# Altium schematic sheet 04_USB_PWR.SchDoc: USB & POWER
size 594 x 420 mm; Author: T. Ludemann; SheetNumber: 4; SheetTotal: 8; DocSize: DINA2
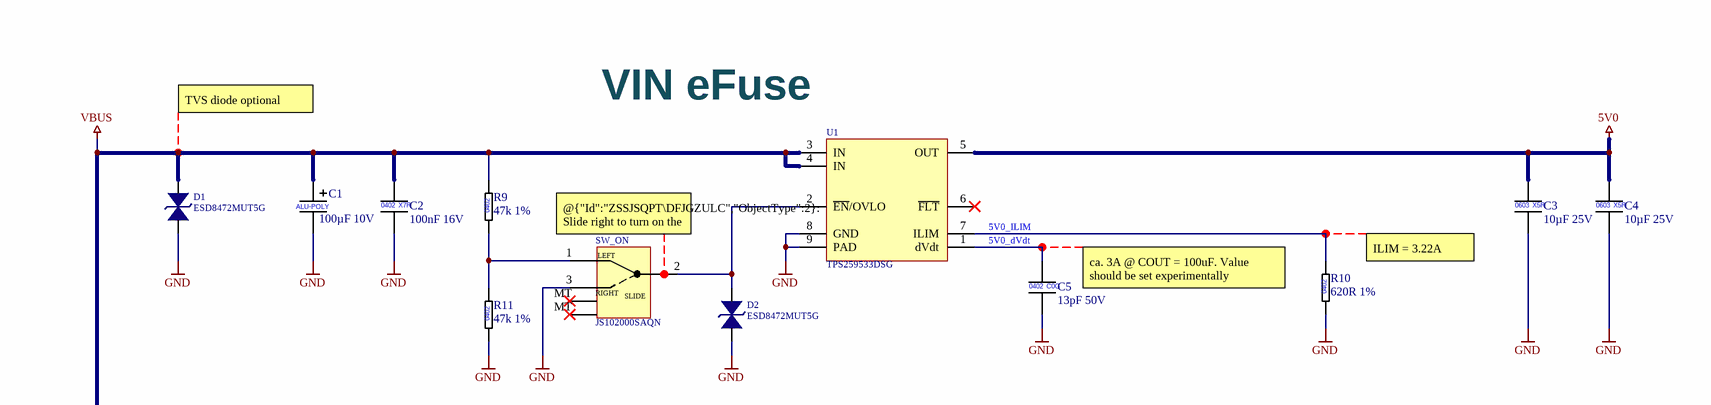
[diagram p0: 04_USB_PWR.SchDoc, top left]
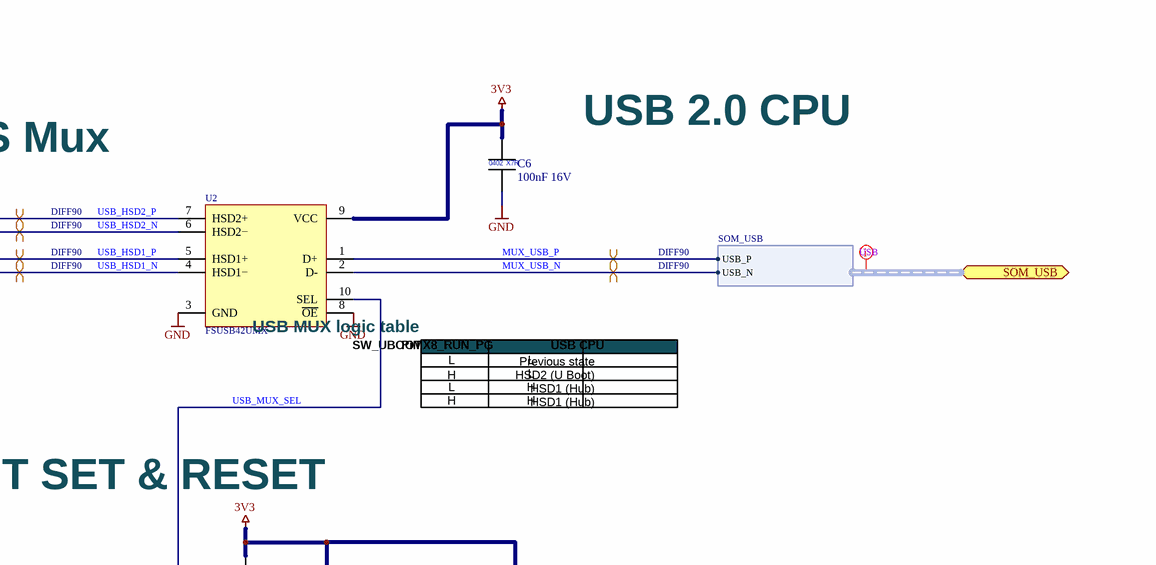
[diagram p1: 04_USB_PWR.SchDoc, top right]
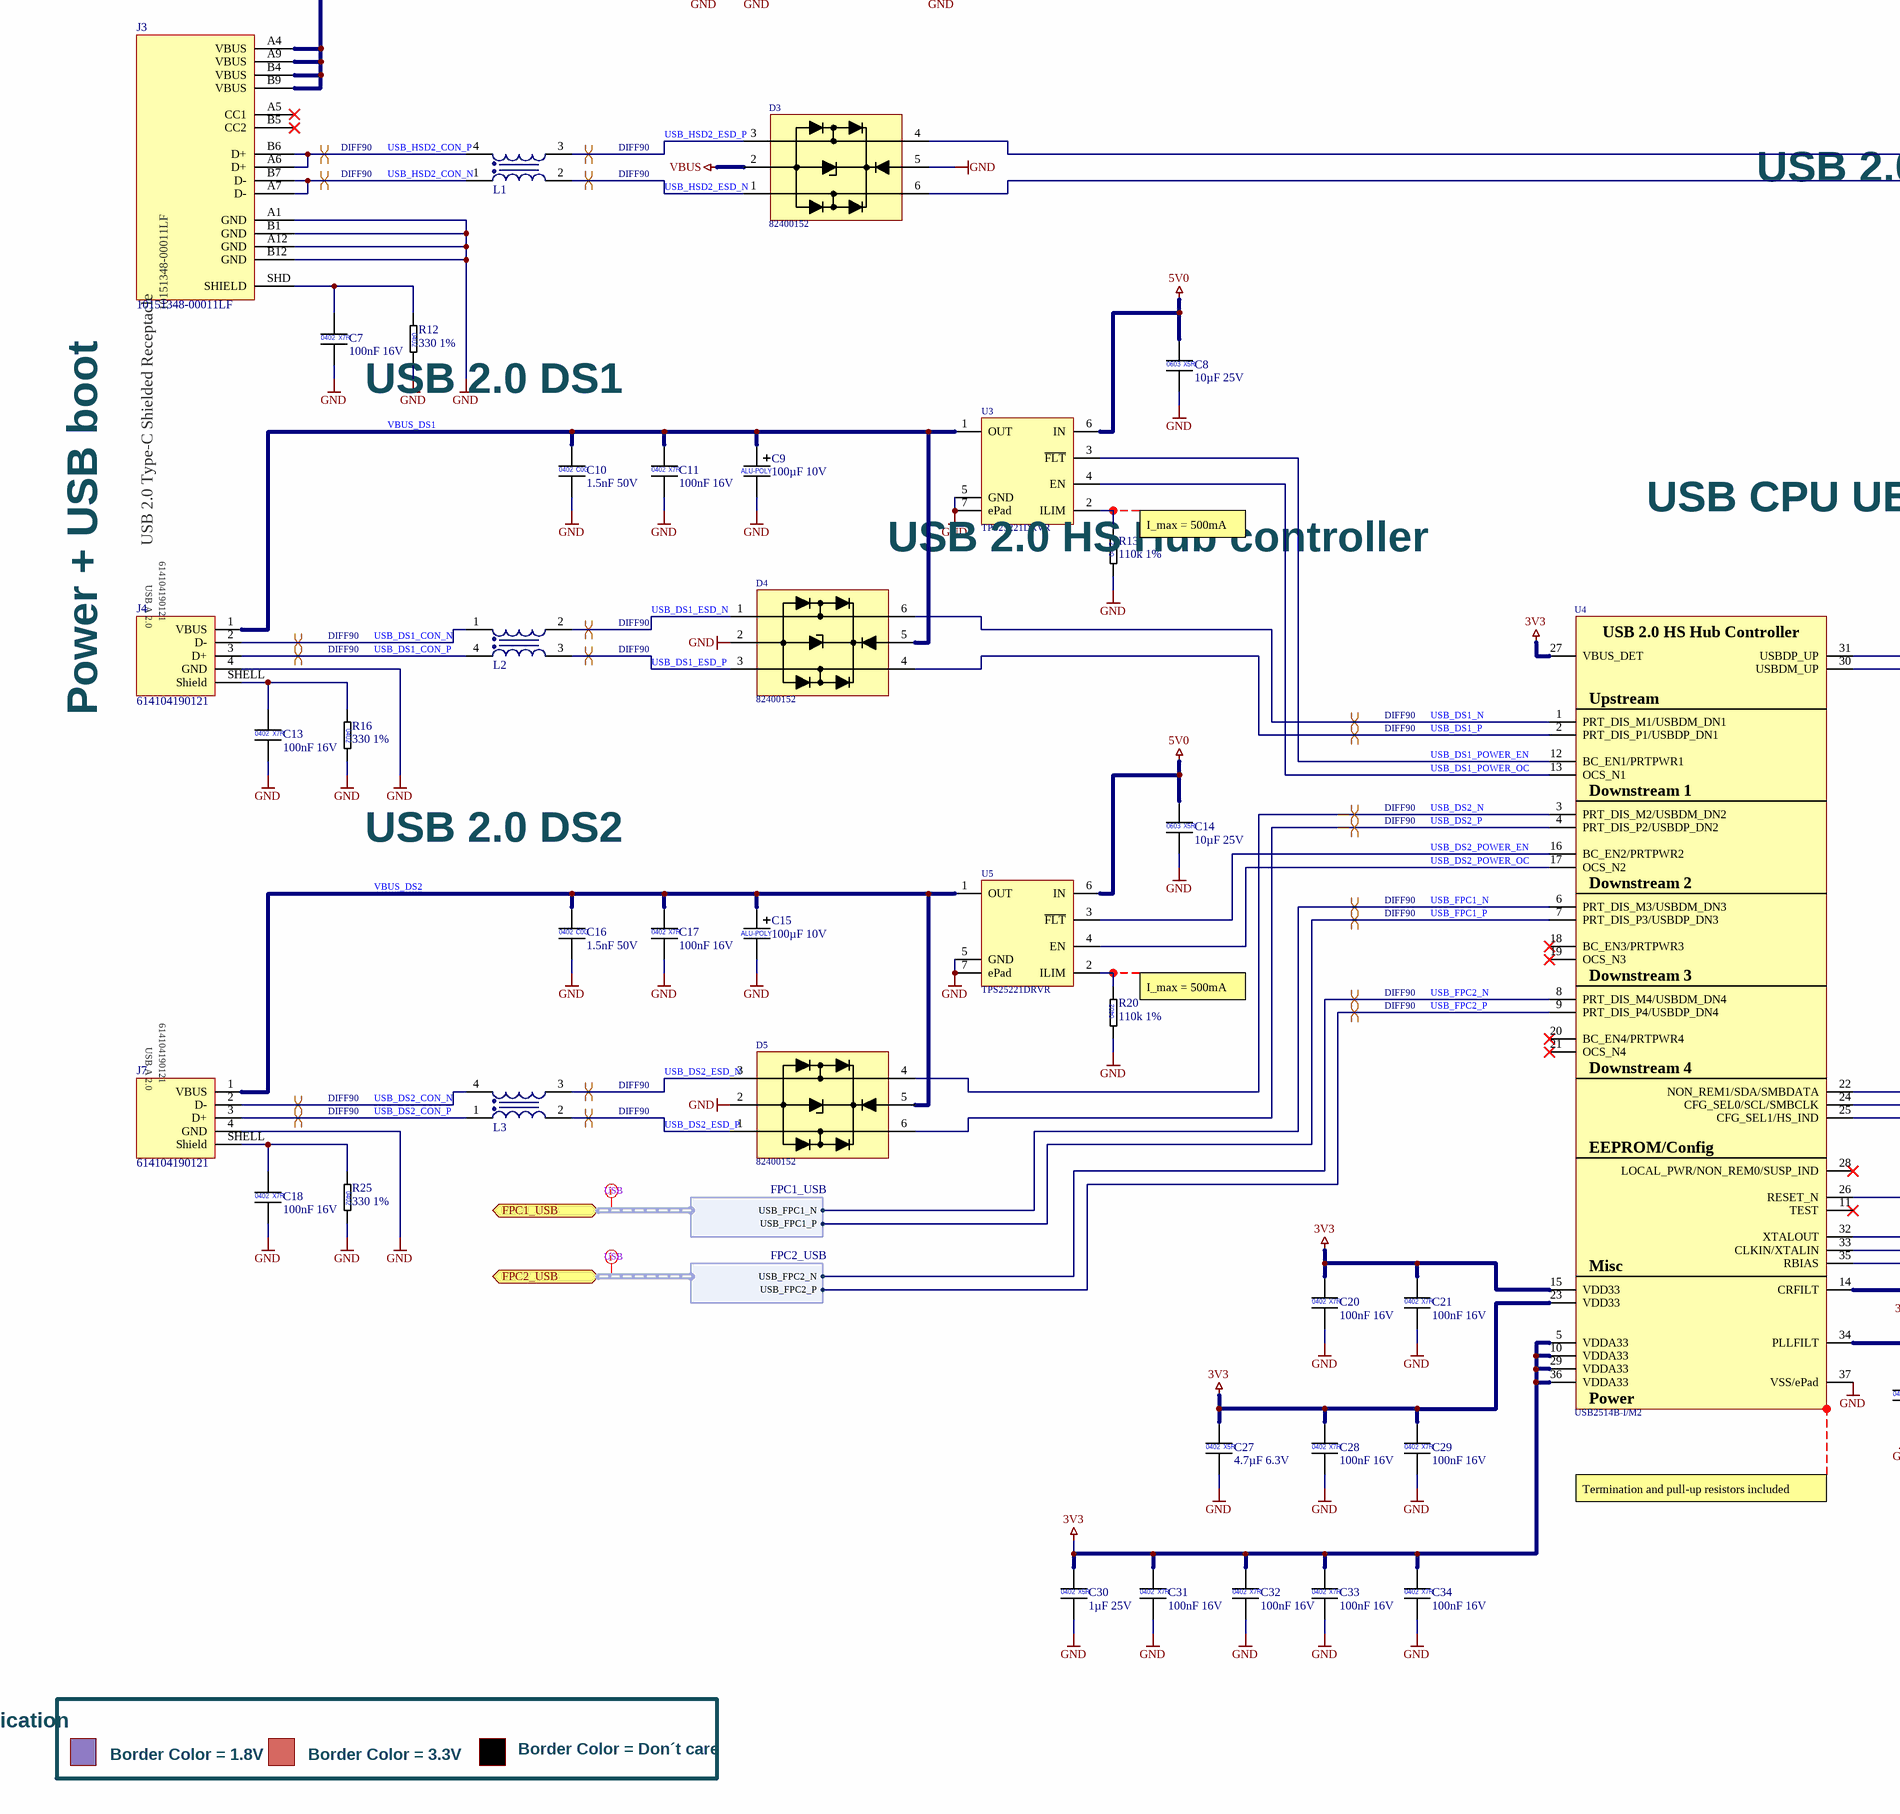
[diagram p2: 04_USB_PWR.SchDoc, bottom left]
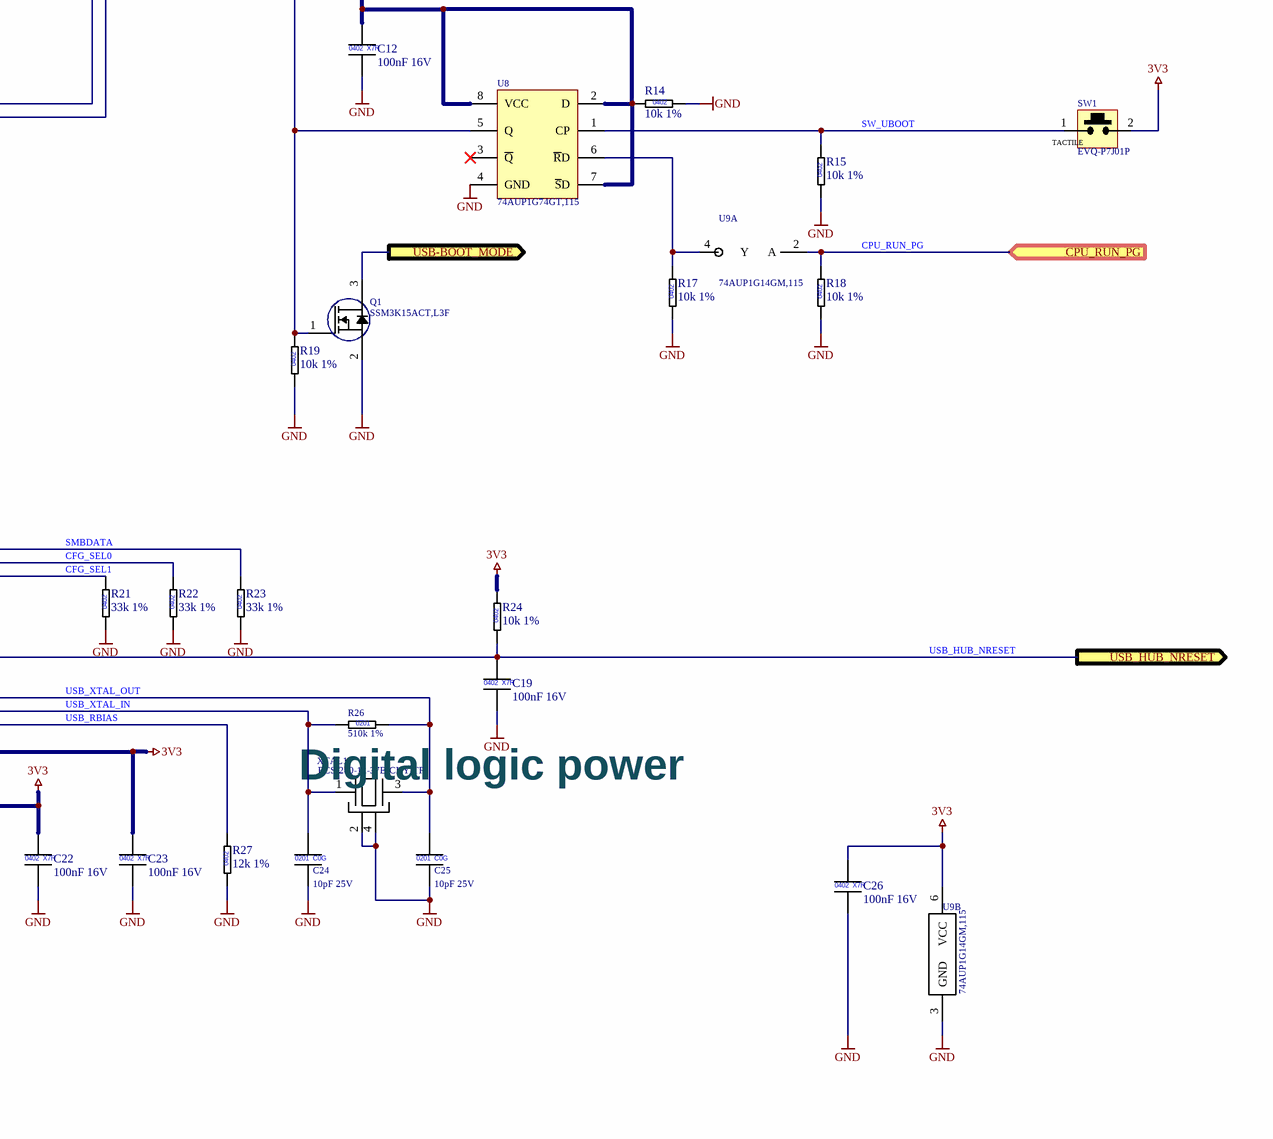
[diagram p3: 04_USB_PWR.SchDoc, bottom right]

## Parts
?  (no value)  (graphical)
C1  100µF 10V  [CAP_Radial_5x8mm]
C2  100nF 16V  [CAPC1005X06L]
C3  10µF 25V  [CAPC1608X10L]
C4  10µF 25V  [CAPC1608X10L]
C5  13pF 50V  [CAPC1005X06L]
C6  100nF 16V  [CAPC1005X06L]
C7  100nF 16V  [CAPC1005X06L]
C8  10µF 25V  [CAPC1608X10L]
C9  100µF 10V  [CAP_Radial_5x8mm]
C10  1.5nF 50V  [CAPC1005X06L]
C11  100nF 16V  [CAPC1005X06L]
C12  100nF 16V  [CAPC1005X06L]
C13  100nF 16V  [CAPC1005X06L]
C14  10µF 25V  [CAPC1608X10L]
C15  100µF 10V  [CAP_Radial_5x8mm]
C16  1.5nF 50V  [CAPC1005X06L]
C17  100nF 16V  [CAPC1005X06L]
C18  100nF 16V  [CAPC1005X06L]
C19  100nF 16V  [CAPC1005X06L]
C20  100nF 16V  [CAPC1005X06L]
C21  100nF 16V  [CAPC1005X06L]
C22  100nF 16V  [CAPC1005X06L]
C23  100nF 16V  [CAPC1005X06L]
C24  10pF 25V  [CAPC0603X03L]
C25  10pF 25V  [CAPC0603X03L]
C26  100nF 16V  [CAPC1005X06L]
C27  4.7µF 6.3V  [CAPC1005X06L]
C28  100nF 16V  [CAPC1005X06L]
C29  100nF 16V  [CAPC1005X06L]
C30  1µF 25V  [CAPC1005X06L]
C31  100nF 16V  [CAPC1005X06L]
C32  100nF 16V  [CAPC1005X06L]
C33  100nF 16V  [CAPC1005X06L]
C34  100nF 16V  [CAPC1005X06L]
D1  ESD8472MUT5G  [DFN36P62X33-2L]
D2  ESD8472MUT5G  [DFN36P62X33-2L]
D3  82400152  [WE-TVS_SOT563]
D4  82400152  [WE-TVS_SOT563]
D5  82400152  [WE-TVS_SOT563]
J3  10151348-00011LF  [USB Type C - 10151348-00011LF]
J4  614104190121  [USB Type A - 614104190121]
J7  614104190121  [USB Type A - 614104190121]
L1  90Ohm 100mA  [WE-CNSW_0603]  (value not drawn)
L2  90Ohm 100mA  [WE-CNSW_0603]  (value not drawn)
L3  90Ohm 100mA  [WE-CNSW_0603]  (value not drawn)
Q1  SSM3K15ACT,L3F  [DFN65P100X50-3L]
R9  47k 1%  [RESC1005X04L]
R10  620R 1%  [RESC1005X04L]
R11  47k 1%  [RESC1005X04L]
R12  330 1%  [RESC1005X04L]
R13  110k 1%  [RESC1005X04L]
R14  10k 1%  [RESC1005X04L]
R15  10k 1%  [RESC1005X04L]
R16  330 1%  [RESC1005X04L]
R17  10k 1%  [RESC1005X04L]
R18  10k 1%  [RESC1005X04L]
R19  10k 1%  [RESC1005X04L]
R20  110k 1%  [RESC1005X04L]
R21  33k 1%  [RESC1005X04L]
R22  33k 1%  [RESC1005X04L]
R23  33k 1%  [RESC1005X04L]
R24  10k 1%  [RESC1005X04L]
R25  330 1%  [RESC1005X04L]
R26  510k 1%  [RESC0603X03L]
R27  12k 1%  [RESC1005X04L]
SW1  EVQ-P7J01P  [SW_TACT_EVQ-P7J01P]
SW_ON  JS102000SAQN  [SW_SLIDE-SWITCH_JS102000SAQN]
U1  TPS259533DSG  [SON50P200X80_HS-9N]
U2  FSUSB42UMX  [FSUSB42_UQFN10 1.4x1.8, 0.4P]
U3  TPS25221DRVR  [SON65P200X80_HS-7N]
U4  USB2514B-I/M2  [QFN50P600X600X100_HS-37M]
U5  TPS25221DRVR  [SON65P200X80_HS-7N]
U8  74AUP1G74GT,115  [PSON50P100X50-8L]
U9  74AUP1G14GM,115  [PSON50P140X100X50-6L]  (parts A,B of 2)
XTAL1  ECS-240-12-37B-CKY-TR  [XTAL_ECX-1637B_2X1.6X0.5]

## Ports
CPU_RUN_PG (in), FPC1_USB (bidir, harness FPC1_USB), FPC2_USB (bidir, harness FPC2_USB), SOM_USB (bidir, harness SOM_USB), USB-BOOT_MODE (out), USB_HUB_NRESET (out)

## Harnesses
SOM_USB: USB_P, USB_N
FPC1_USB: USB_FPC1_P, USB_FPC1_N
FPC2_USB: USB_FPC2_P, USB_FPC2_N

## Nets
3V3: C6.1 C12.1 C20.1 C21.1 C22.1 C23.1 C26.1 C27.1 C28.1 C29.1 C30.1 C31.1 C32.1 C33.1 C34.1 R14.1 R24.2 SW1.2 U2.9(VCC) U4.5(VDDA33) U4.10(VDDA33) U4.14(CRFILT) U4.15(VDD33) U4.23(VDD33) U4.27(VBUS_DET) U4.29(VDDA33) U4.34(PLLFILT) U4.36(VDDA33) U8.2(D) U8.7(~{S}D) U8.8(VCC) U9.6(VCC)
5V0: C3.1 C4.1 C8.1 C14.1 U1.5(OUT) U3.6(IN) U5.6(IN)
GND: C1.2 C2.2 C3.2 C4.2 C5.2 C6.2 C7.2 C8.2 C9.2 C10.2 C11.2 C12.2 C13.2 C14.2 C15.2 C16.2 C17.2 C18.2 C19.2 C20.2 C21.2 C22.2 C23.2 C24.2 C25.2 C26.2 C27.2 C28.2 C29.2 C30.2 C31.2 C32.2 C33.2 C34.2 D1.2 D2.2 D3.5(VDD) D4.2(GND) D5.2(GND) J3.A1(GND) J3.A12(GND) J3.B1(GND) J3.B12(GND) J4.4(GND) J7.4(GND) Q1.2(S) R10.1 R11.1 R12.2 R13.1 R14.2 R15.1 R16.2 R17.1 R18.1 R19.1 R20.1 R21.1 R22.1 R23.1 R25.2 R27.1 SW_ON.3 U1.8(GND) U1.9(PAD) U2.3(GND) U2.8(~{OE}) U3.5(GND) U3.7(ePad) U4.37(VSS/ePad) U5.5(GND) U5.7(ePad) U8.4(GND) U9.3(GND) XTAL1.2 XTAL1.4
VBUS: C1.1 C2.1 D1.1 D3.2(GND) J3.A4(VBUS) J3.A9(VBUS) J3.B4(VBUS) J3.B9(VBUS) R9.2 U1.3(IN) U1.4(IN)
5V0_dVdt: C5.1 U1.1(dVdt)
5V0_ILIM: R10.2 U1.7(ILIM)
CFG_SEL0: R22.2 U4.24(CFG_SEL0/SCL/SMBCLK)
CFG_SEL1: R21.2 U4.25(CFG_SEL1/HS_IND)
CPU_RUN_PG: R18.2 U9.2(A) ; port CPU_RUN_PG
MUX_USB_N: U2.2(D-) ; port SOM_USB.USB_N
MUX_USB_P: U2.1(D+) ; port SOM_USB.USB_P
SMBDATA: R23.2 U4.22(NON_REM1/SDA/SMBDATA)
SW_UBOOT: R15.2 SW1.1 U8.1(CP)
USB-BOOT_MODE: Q1.3(D) ; port USB-BOOT_MODE
USB_DS1_CON_N: J4.2(D-) L2.1
USB_DS1_CON_P: J4.3(D+) L2.4
USB_DS1_ESD_N: D4.1(I/O_1) L2.2
USB_DS1_ESD_P: D4.3(I/O_2) L2.3
USB_DS1_N: D4.6(I/O_1) U4.1(PRT_DIS_M1/USBDM_DN1)
USB_DS1_P: D4.4(I/O_2) U4.2(PRT_DIS_P1/USBDP_DN1)
USB_DS1_POWER_EN: U3.3(~{FLT}) U4.12(BC_EN1/PRTPWR1)
USB_DS1_POWER_OC: U3.4(EN) U4.13(OCS_N1)
USB_DS2_CON_N: J7.2(D-) L3.4
USB_DS2_CON_P: J7.3(D+) L3.1
USB_DS2_ESD_N: D5.3(I/O_2) L3.3
USB_DS2_ESD_P: D5.1(I/O_1) L3.2
USB_DS2_N: D5.4(I/O_2) U4.3(PRT_DIS_M2/USBDM_DN2)
USB_DS2_P: D5.6(I/O_1) U4.4(PRT_DIS_P2/USBDP_DN2)
USB_DS2_POWER_EN: U4.16(BC_EN2/PRTPWR2) U5.3(~{FLT})
USB_DS2_POWER_OC: U4.17(OCS_N2) U5.4(EN)
USB_FPC1_N: U4.6(PRT_DIS_M3/USBDM_DN3) ; port FPC1_USB.USB_FPC1_N
USB_FPC1_P: U4.7(PRT_DIS_P3/USBDP_DN3) ; port FPC1_USB.USB_FPC1_P
USB_FPC2_N: U4.8(PRT_DIS_M4/USBDM_DN4) ; port FPC2_USB.USB_FPC2_N
USB_FPC2_P: U4.9(PRT_DIS_P4/USBDP_DN4) ; port FPC2_USB.USB_FPC2_P
USB_HSD1_N: U2.4(HSD1−) U4.30(USBDM_UP)
USB_HSD1_P: U2.5(HSD1+) U4.31(USBDP_UP)
USB_HSD2_CON_N: J3.A7(D-) J3.B7(D-) L1.1
USB_HSD2_CON_P: J3.A6(D+) J3.B6(D+) L1.4
USB_HSD2_ESD_N: D3.1(I/O_1) L1.2
USB_HSD2_ESD_P: D3.3(I/O_2) L1.3
USB_HSD2_N: D3.6(I/O_1) U2.6(HSD2−)
USB_HSD2_P: D3.4(I/O_2) U2.7(HSD2+)
USB_HUB_NRESET: C19.1 R24.1 U4.26(RESET_N) ; port USB_HUB_NRESET
USB_MUX_SEL: Q1.1(G) R19.2 U2.10(SEL) U8.5(Q)
USB_RBIAS: R27.2 U4.35(RBIAS)
USB_XTAL_IN: C24.1 R26.1 U4.33(CLKIN/XTALIN) XTAL1.1
USB_XTAL_OUT: C25.1 R26.2 U4.32(XTALOUT) XTAL1.3
VBUS_DS1: C9.1 C10.1 C11.1 D4.5(VDD) J4.1(VBUS) U3.1(OUT)
VBUS_DS2: C15.1 C16.1 C17.1 D5.5(VDD) J7.1(VBUS) U5.1(OUT)
NetC7_1: C7.1 J3.SHD(SHIELD) R12.1
NetC13_1: C13.1 J4.SHELL(Shield) R16.1
NetC18_1: C18.1 J7.SHELL(Shield) R25.1
NetD2_1: D2.1 SW_ON.2(CMN) U1.2(~{EN}/OVLO)
NetR9_1: R9.1 R11.2 SW_ON.1
NetR13_2: R13.2 U3.2(ILIM)
NetR17_2: R17.2 U8.6(~{R}D) U9.4(Y)
NetR20_2: R20.2 U5.2(ILIM)

Not connected (* = marked no-connect by the designer): J3 A5(CC1)* B5(CC2)*; SW_ON MT*; U1 6(~{FLT})*; U4 11(TEST)* 18(BC_EN3/PRTPWR3)* 19(OCS_N3)* 20(BC_EN4/PRTPWR4)* 21(OCS_N4)* 28(LOCAL_PWR/NON_REM0/SUSP_IND)*; U8 3(~{Q})*

## Layout directives
differential pair; differential pair class DIFF90: MUX_USB_N, MUX_USB_P, USB_DS1_CON_N, USB_DS1_CON_P, USB_DS1_ESD_N, USB_DS1_ESD_P, USB_DS1_N, USB_DS1_P, USB_DS2_CON_N, USB_DS2_CON_P, USB_DS2_ESD_N, USB_DS2_ESD_P, USB_DS2_N, USB_DS2_P, USB_FPC1_N, USB_FPC1_P, USB_FPC2_N, USB_FPC2_P, USB_HSD1_N, USB_HSD1_P, USB_HSD2_CON_N, USB_HSD2_CON_P, USB_HSD2_ESD_N, USB_HSD2_ESD_P, USB_HSD2_N, USB_HSD2_P
net class USB: (no net found under the mark)

## Notes on the sheet
- TVS diode optional
- (near U1) VIN eFuse
- (near SW_ON) @{"Id":"ZSSJSQPT\DFJGZULC","ObjectType":2}: Slide right to turn on the system
- ca. 3A @ COUT = 100uF. Value should be set experimentally
- ILIM = 3.22A
- USB 2.0 CPU
- USB 2.0 HS Mux
- Power + USB boot
- USB 2.0 DS1
- USB MUX logic table
- SW_UBOOT
- L
- H
- PiMX8_RUN_PG
- Previous state
- HSD2 (U Boot)
- HSD1 (Hub)
- USB CPU
- (near R13) I_max = 500mA
- USB 2.0 HS Hub controller
- USB CPU UBOOT SET & RESET
- USB 2.0 DS2
- (near R20) I_max = 500mA
- Digital logic power
- Termination and pull-up resistors included
- Signal Level Indication
- Border Color = 1.8V
- Border Color = 3.3V
- Border Color = Don´t care
- OV Tech GmbH - Open Visions Technology
- (in symbol CAP_0201_10pF_25V) 0201; C0G
- (in symbol CAP_0402_1.5nF_50V) 0402; C0G
- (in symbol CAP_0402_1µ_25V) 0402; X5R
- (in symbol CAP_0402_4.7µ_6.3V) 0402; X5R
- (in symbol CAP_0402_13pF_50V) 0402; C0G
- (in symbol CAP_0402_100nF_16V) 0402; X7R
- (in symbol CAP_0603_10µ_25V) 0603; X5R
- (in symbol CAP_POLY_100µ_10V) ALU-POLY
- (in symbol RES_0201_510k_1%) 0201
- (in symbol RES_0402_10k_1%) 0402
- (in symbol RES_0402_12k_1%) 0402
- (in symbol RES_0402_33k_1%) 0402
- (in symbol RES_0402_47k_1%) 0402
- (in symbol RES_0402_110k_1%) 0402
- (in symbol RES_0402_330R_1%) 0402
- (in symbol RES_0402_620R_1%) 0402
- (in symbol SW_SLIDE-SWITCH_JS102000SAQN) LEFT; RIGHT; SLIDE
- (in symbol SW_TACTILE_EVQ-P7J01P) TACTILE
- (in symbol USB 2.0 Type-C Receptacle_10151348-00011LF) USB 2.0 Type-C Shielded Receptacle
- (in symbol USB 4-Port USB 2.0 Hi-Speed Hub Controller USB2514B) USB 2.0 HS Hub Controller; Upstream; Downstream 1; Downstream 2; Downstream 3; Downstream 4; EEPROM/Config; Misc; Power
- (in symbol USB Type A - 614104190121) USB A 2.0

## Library data of the parts
? = Titleblock_01_OpenSource
C1 C9 C15 = CAP_POLY_100µ_10V: Aluminium-Polymer capacitor  radial 10VDC; Manufacturer 1: KEMET; Manufacturer 1 Prt. Nr.: A750BK107M1AAAE024
C2 C6 C7 C11-C13 C17-C23 C26 C28 C29 C31-C34 = CAP_0402_100nF_16V: Multilayer Ceramic Capacitors MLCC - SMD/SMT 0402 16VDC; Manufacturer 1: KYOCERA AVX; Manufacturer 1 Prt. Nr.: KGM05AR71C104KH; Manufacturer 2 Prt. Nr.: EMK105B7104KV-F; Manufacturer 2: Taiyo Yuden
C3 C4 C8 C14 = CAP_0603_10µ_25V: Multilayer Ceramic Capacitors MLCC - SMD/SMT 0603 25VDC; Manufacturer 1: Murata Electronics; Manufacturer 1 Prt. Nr.: GRM188R61E106KA73J; Manufacturer 2 Prt. Nr.: CL10A106MA8NRNC; Manufacturer 2: Samsung Electro-Mechanics
C5 = CAP_0402_13pF_50V: Multilayer Ceramic Capacitors MLCC - SMD/SMT 0402 50VDC; Manufacturer 1: Murata Electronics; Manufacturer 1 Prt. Nr.: GRT1555C1H130FA02D; Manufacturer 2 Prt. Nr.: CQ0402FRNPO9BN130; Manufacturer 2: YAGEO
C10 C16 = CAP_0402_1.5nF_50V: Multilayer Ceramic Capacitors MLCC - SMD/SMT 0402 50VDC; Manufacturer 1: Murata Electronics; Manufacturer 1 Prt. Nr.: GRM1555C1H152JA01D; Manufacturer 2 Prt. Nr.: C0402C152J5GACTU; Manufacturer 2: KEMET
C24 C25 = CAP_0201_10pF_25V: Multilayer Ceramic Capacitors MLCC - SMD/SMT 0201 25VDC; Manufacturer 1: Murata Electronics; Manufacturer 1 Prt. Nr.: GJM0335C1E100JB01D; Manufacturer 2 Prt. Nr.: CQ0201JRNPO8BN100; Manufacturer 2: YAGEO
C27 = CAP_0402_4.7µ_6.3V: Multilayer Ceramic Capacitors MLCC - SMD/SMT 0402 6.3VDC; Manufacturer 1: Murata Electronics; Manufacturer 1 Prt. Nr.: GRM155R60J475ME47D; Manufacturer 2 Prt. Nr.: JMK105BC6475MV-F; Manufacturer 2: Taiyo Yuden
C30 = CAP_0402_1µ_25V: Multilayer Ceramic Capacitors MLCC - SMD/SMT 0402 25VDC; Manufacturer 1: Murata Electronics; Manufacturer 1 Prt. Nr.: GRM155R61E105KE11D; Manufacturer 2 Prt. Nr.: 0402X105K250CT; Manufacturer 2: Walsin
D1 D2 = ESD Protection Diode_5.3V_ESD8472MUT5G: ESD Diode Suppressors Bidirectional 5V working voltage X3DFN-2 Package; Manufacturer 1: Onsemi; Manufacturer 1 Prt. Nr.: ESD8472MUT5G
D3-D5 = ESD 5.5V_82400152: WE-TVS TVS Diode – High Speed / Series; Manufacturer 1: Würth Elektronik; Manufacturer 1 Prt. Nr.: 82400152
J3 = USB 2.0 Type-C Receptacle_10151348-00011LF: USB 2.0 C Receptacle Upright Through Hole 14P G/F; Manufacturer 1: Amphenol; Manufacturer 1 Prt. Nr.: 10151348-00011LF
J4 J7 = USB Type A - 614104190121: WR-COM USB 2.0 Type A Horizontal THT Short Type; Manufacturer 1: Würth Elektronik; Manufacturer 1 Prt. Nr.: 614104190121
L1-L3 = Common Mode Choke_744230900: WE-CNSW SMT Common Mode / Line Filter; Manufacturer 1: Würth Elektronik; Manufacturer 1 Prt. Nr.: 744230900
Q1 = N-Channel MOSFET_SSM3K15ACT,L3F: MOSFET 30V SGL N-CH TRENCHMOS Logic Level; Manufacturer 1: Toshiba; Manufacturer 1 Prt. Nr.: SSM3K15ACT,L3F
R9 R11 = RES_0402_47k_1%: Thick Film Resistors - SMD 47k 1%; Manufacturer 1: Vishay / Dale; Manufacturer 1 Prt. Nr.: CRCW040247K0FKEDC; Manufacturer 2 Prt. Nr.: RT0402FRE0747KL; Manufacturer 2: YAGEO
R10 = RES_0402_620R_1%: Thick Film Resistors - SMD 620R 1%; Manufacturer 1: Bourns; Manufacturer 1 Prt. Nr.: CR0402-FX-6200GLF; Manufacturer 2 Prt. Nr.: CRCW0402620RFKTD; Manufacturer 2: Vishay / Dale
R12 R16 R25 = RES_0402_330R_1%: Thick Film Resistors - SMD 330 Ohm 1%; Manufacturer 1: Vishay / Dale; Manufacturer 1 Prt. Nr.: CRCW0402330RFKED; Manufacturer 2 Prt. Nr.: CR0402-FX-3300GLF; Manufacturer 2: Bourns
R13 R20 = RES_0402_110k_1%: Thick Film Resistors - SMD 110k 1%; Manufacturer 1: Würth Elektronik; Manufacturer 1 Prt. Nr.: 560112110186; Manufacturer 2 Prt. Nr.: CR0402-FX-1103GLF; Manufacturer 2: Bourns
R14 R15 R17-R19 R24 = RES_0402_10k_1%: Thick Film Resistors - SMD 10k 1%; Manufacturer 1: Vishay / Dale; Manufacturer 1 Prt. Nr.: CRCW040210K0FKEDC; Manufacturer 2 Prt. Nr.: RT0402FRE0710KL; Manufacturer 2: YAGEO
R21-R23 = RES_0402_33k_1%: Thick Film Resistors - SMD 33k 1%; Manufacturer 1: Vishay / Dale; Manufacturer 1 Prt. Nr.: CRCW040233K0FKEDC; Manufacturer 2 Prt. Nr.: RC0402FR-1333KL; Manufacturer 2: YAGEO
R26 = RES_0201_510k_1%: Thick Film Resistors - SMD 510 kOHM 1%; Manufacturer 1: Yageo; Manufacturer 1 Prt. Nr.: RC0201FR-07510KL; Manufacturer 2 Prt. Nr.: CRCW0201510KFNED; Manufacturer 2: Vishay / Dale
R27 = RES_0402_12k_1%: Thick Film Resistors - SMD 12kOhm 1%; Manufacturer 1: Vishay / Dale; Manufacturer 1 Prt. Nr.: CRCW040212K0FKED; Manufacturer 2 Prt. Nr.: AR0402FR-0712KL; Manufacturer 2: YAGEO
SW1 = SW_TACTILE_EVQ-P7J01P: SMD Switch Tactile SMD 3.2mm X 2.9mm; Manufacturer 1: Panasonic; Manufacturer 1 Prt. Nr.: EVQ-P7J01P
SW_ON = SW_SLIDE-SWITCH_JS102000SAQN: Sub-Miniature Slide Switch JS102000SAQN; Manufacturer 1: C&K Switches; Manufacturer 1 Prt. Nr.: JS102000SAQN
U1 = 5V 4A eFuse_TPS259533DSG: PS2595xx 2.7 V to 18 V, 4-A, 34-mΩ eFuse With Fast Overvoltage Protection; Manufacturer 1: Texas Instruments; Manufacturer 1 Prt. Nr.: TPS259533DSG
U2 = USB Switch_FSUSB42UMX: Low-Power, Two-Port, High-Speed, USB2.0 (480Mbps) UART Switch; Manufacturer 1: ONSEMI; Manufacturer 1 Prt. Nr.: FSUSB42UMX
U3 U5 = Power Switch with programmable current limit TPS25221DRVR: 0.275-2.7A adj. ILIMIT, 2.5-5.5V, 70mΩ USB power switch, active-high, reverse blocking; Manufacturer 1: Texas Instruments; Manufacturer 1 Prt. Nr.: TPS25221DRVR
U4 = USB 4-Port USB 2.0 Hi-Speed Hub Controller USB2514B: 4-Port USB 2.0 Hi-Speed Hub Controller; Manufacturer 1: Microchip; Manufacturer 1 Prt. Nr.: USB2514B-I/M2
U8 = D-FLOP_SMG-W-2,0x1,2x1,25-AU: D-type flip-flop with differential output and async set- and reset input; Manufacturer 1: Nexperia; Manufacturer 1 Prt. Nr.: 74AUP1G74GT,115
U9 = Inverter_74AUP1G14GM,115: Single Unbuffered Inverter 74AUP1G14GM,115; Manufacturer 1: Nexperia; Manufacturer 1 Prt. Nr.: 74AUP1G14GM,115
XTAL1 = Crystal_ECX-1637B_24MHz: SMD Crystal 24 MHz 12pF; Manufacturer 1: ECS; Manufacturer 1 Prt. Nr.: ECS-240-12-37B-CKY-TR